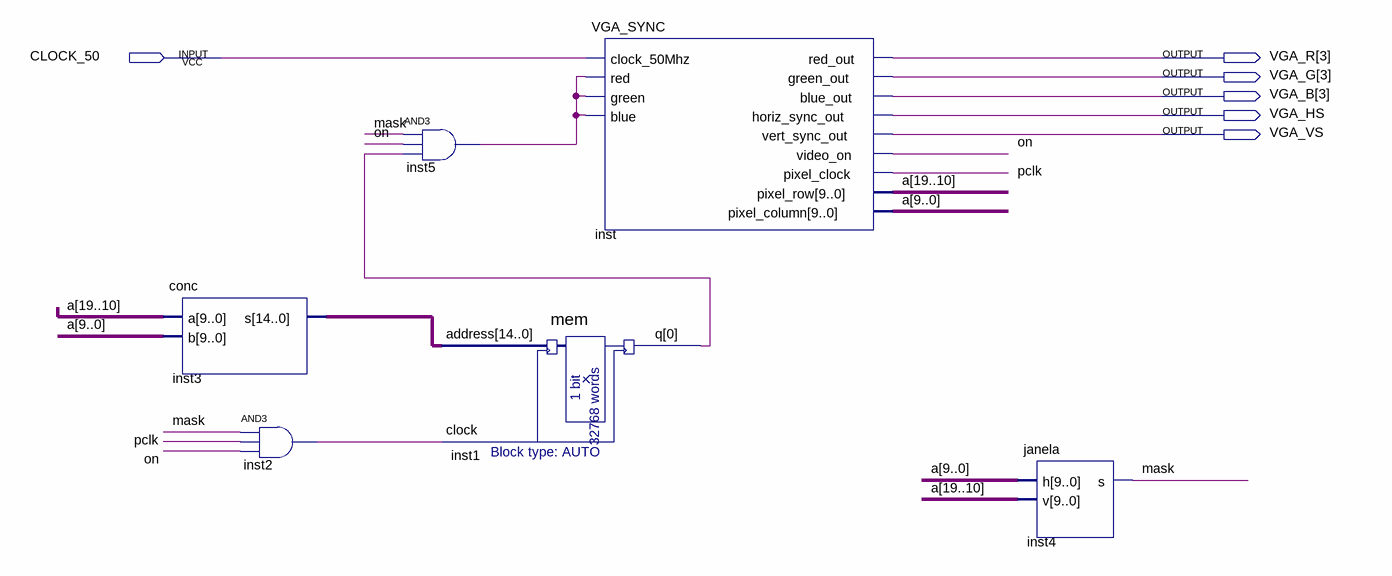
[diagram p0: schematic sheet]
// Quartus schematic projeto1.bdf as structural Verilog: 6 symbols, 6 pins
module projeto1 (
  input  CLOCK_50,
  output [3:3] VGA_R,
  output [3:3] VGA_G,
  output [3:3] VGA_B,
  output VGA_HS,
  output VGA_VS
);

  wire inst1_q, inst2_out, inst5_out, mask, on, pclk;
  wire [14:0] inst3_s;
  wire [19:0] a;

  conc inst3 (.a(a[19:10]), .b(a[9:0]), .s(inst3_s));
  and inst2 (inst2_out, mask, pclk, on);
  and inst5 (inst5_out, mask, on, inst1_q);
  mem inst1 (.address(inst3_s), .clock(inst2_out), .q(inst1_q));
  VGA_SYNC inst (
    .clock_50Mhz(CLOCK_50), .red(inst5_out), .green(inst5_out), .blue(inst5_out), .red_out(VGA_R[3]),
    .green_out(VGA_G[3]), .blue_out(VGA_B[3]), .horiz_sync_out(VGA_HS), .vert_sync_out(VGA_VS),
    .video_on(on), .pixel_clock(pclk), .pixel_row(a[19:10]), .pixel_column(a[9:0]));
  janela inst4 (.h(a[9:0]), .v(a[19:10]), .s(mask));
endmodule
